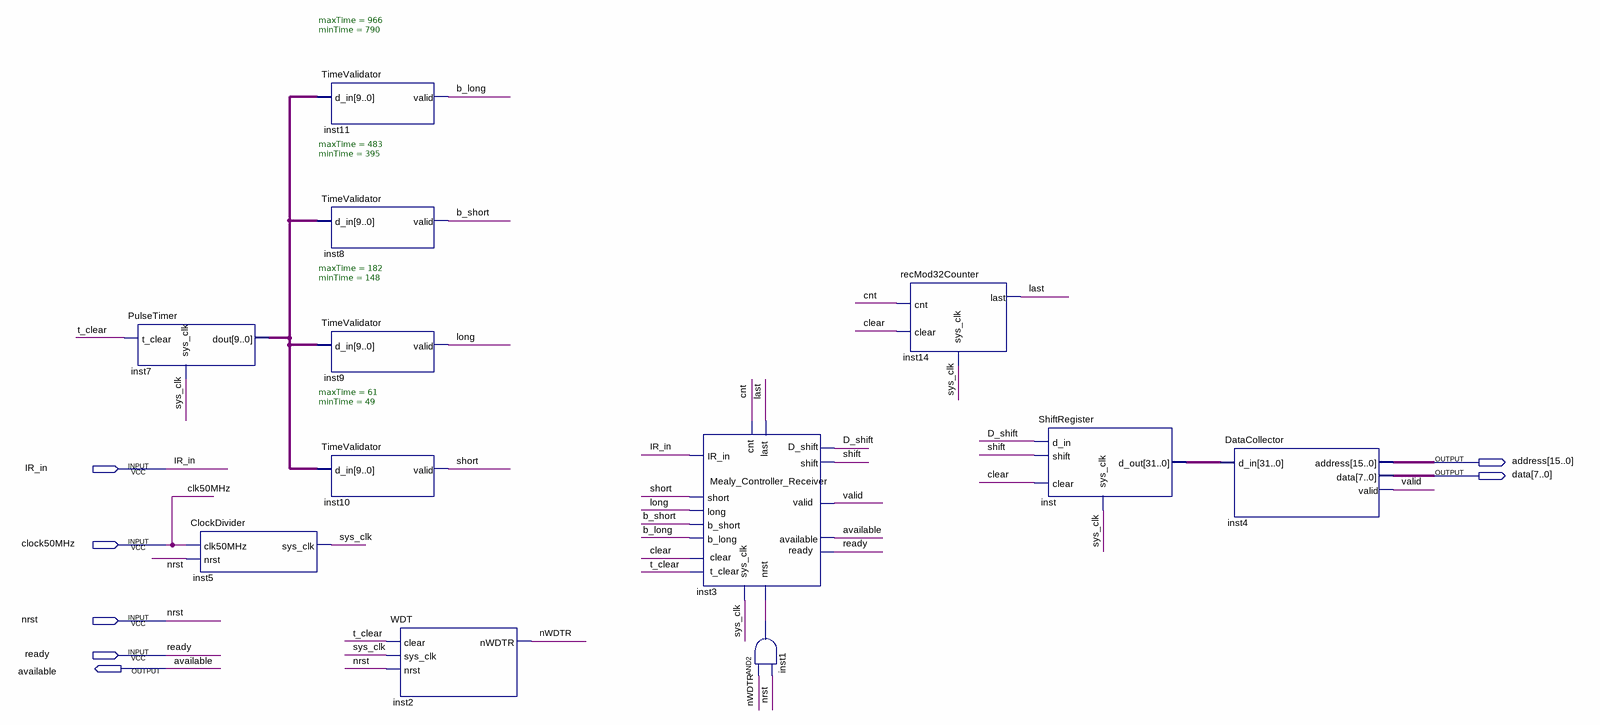
[diagram p0: schematic sheet]
// Quartus schematic NEC_IR_Receiver.bdf as structural Verilog: 12 symbols, 7 pins
module NEC_IR_Receiver (
  input  IR_in,
  input  clock50MHz,
  input  nrst,
  input  ready,
  output [15:0] address,
  output [7:0] data,
  output available
);

  wire b_long, b_short, clear, cnt, D_shift, inst1_out, last, long, nWDTR, shift, short, sys_clk, t_clear,
       valid;
  wire [9:0] inst7_dout;
  wire [31:0] inst_d_out;

  PulseTimer inst7 (.t_clear(t_clear), .sys_clk(sys_clk), .dout(inst7_dout));
  ClockDivider inst5 (.clk50MHz(clock50MHz), .nrst(nrst), .sys_clk(sys_clk));
  TimeValidator #(.maxTime(966), .minTime(790)) inst11 (.d_in(inst7_dout), .valid(b_long));
  TimeValidator #(.maxTime(483), .minTime(395)) inst8 (.d_in(inst7_dout), .valid(b_short));
  TimeValidator #(.maxTime(182), .minTime(148)) inst9 (.d_in(inst7_dout), .valid(long));
  TimeValidator #(.maxTime(61), .minTime(49)) inst10 (.d_in(inst7_dout), .valid(short));
  WDT inst2 (.clear(t_clear), .sys_clk(sys_clk), .nrst(nrst), .nWDTR(nWDTR));
  Mealy_Controller_Receiver inst3 (
    .IR_in(IR_in), .last(last), .short(short), .long(long), .b_short(b_short), .b_long(b_long),
    .valid(valid), .sys_clk(sys_clk), .nrst(inst1_out), .ready(ready), .clear(clear), .shift(shift),
    .D_shift(D_shift), .t_clear(t_clear), .cnt(cnt), .available(available));
  and inst1 (inst1_out, nWDTR, nrst);
  recMod32Counter inst14 (.clear(clear), .sys_clk(sys_clk), .cnt(cnt), .last(last));
  ShiftRegister inst (.d_in(D_shift), .sys_clk(sys_clk), .clear(clear), .shift(shift), .d_out(inst_d_out));
  DataCollector inst4 (.d_in(inst_d_out), .address(address), .data(data), .valid(valid));

  // Other names for the same wires on the sheet: clk50MHz = clock50MHz
endmodule
